# Altium schematic sheet MAX2771-eval.SchDoc
size D
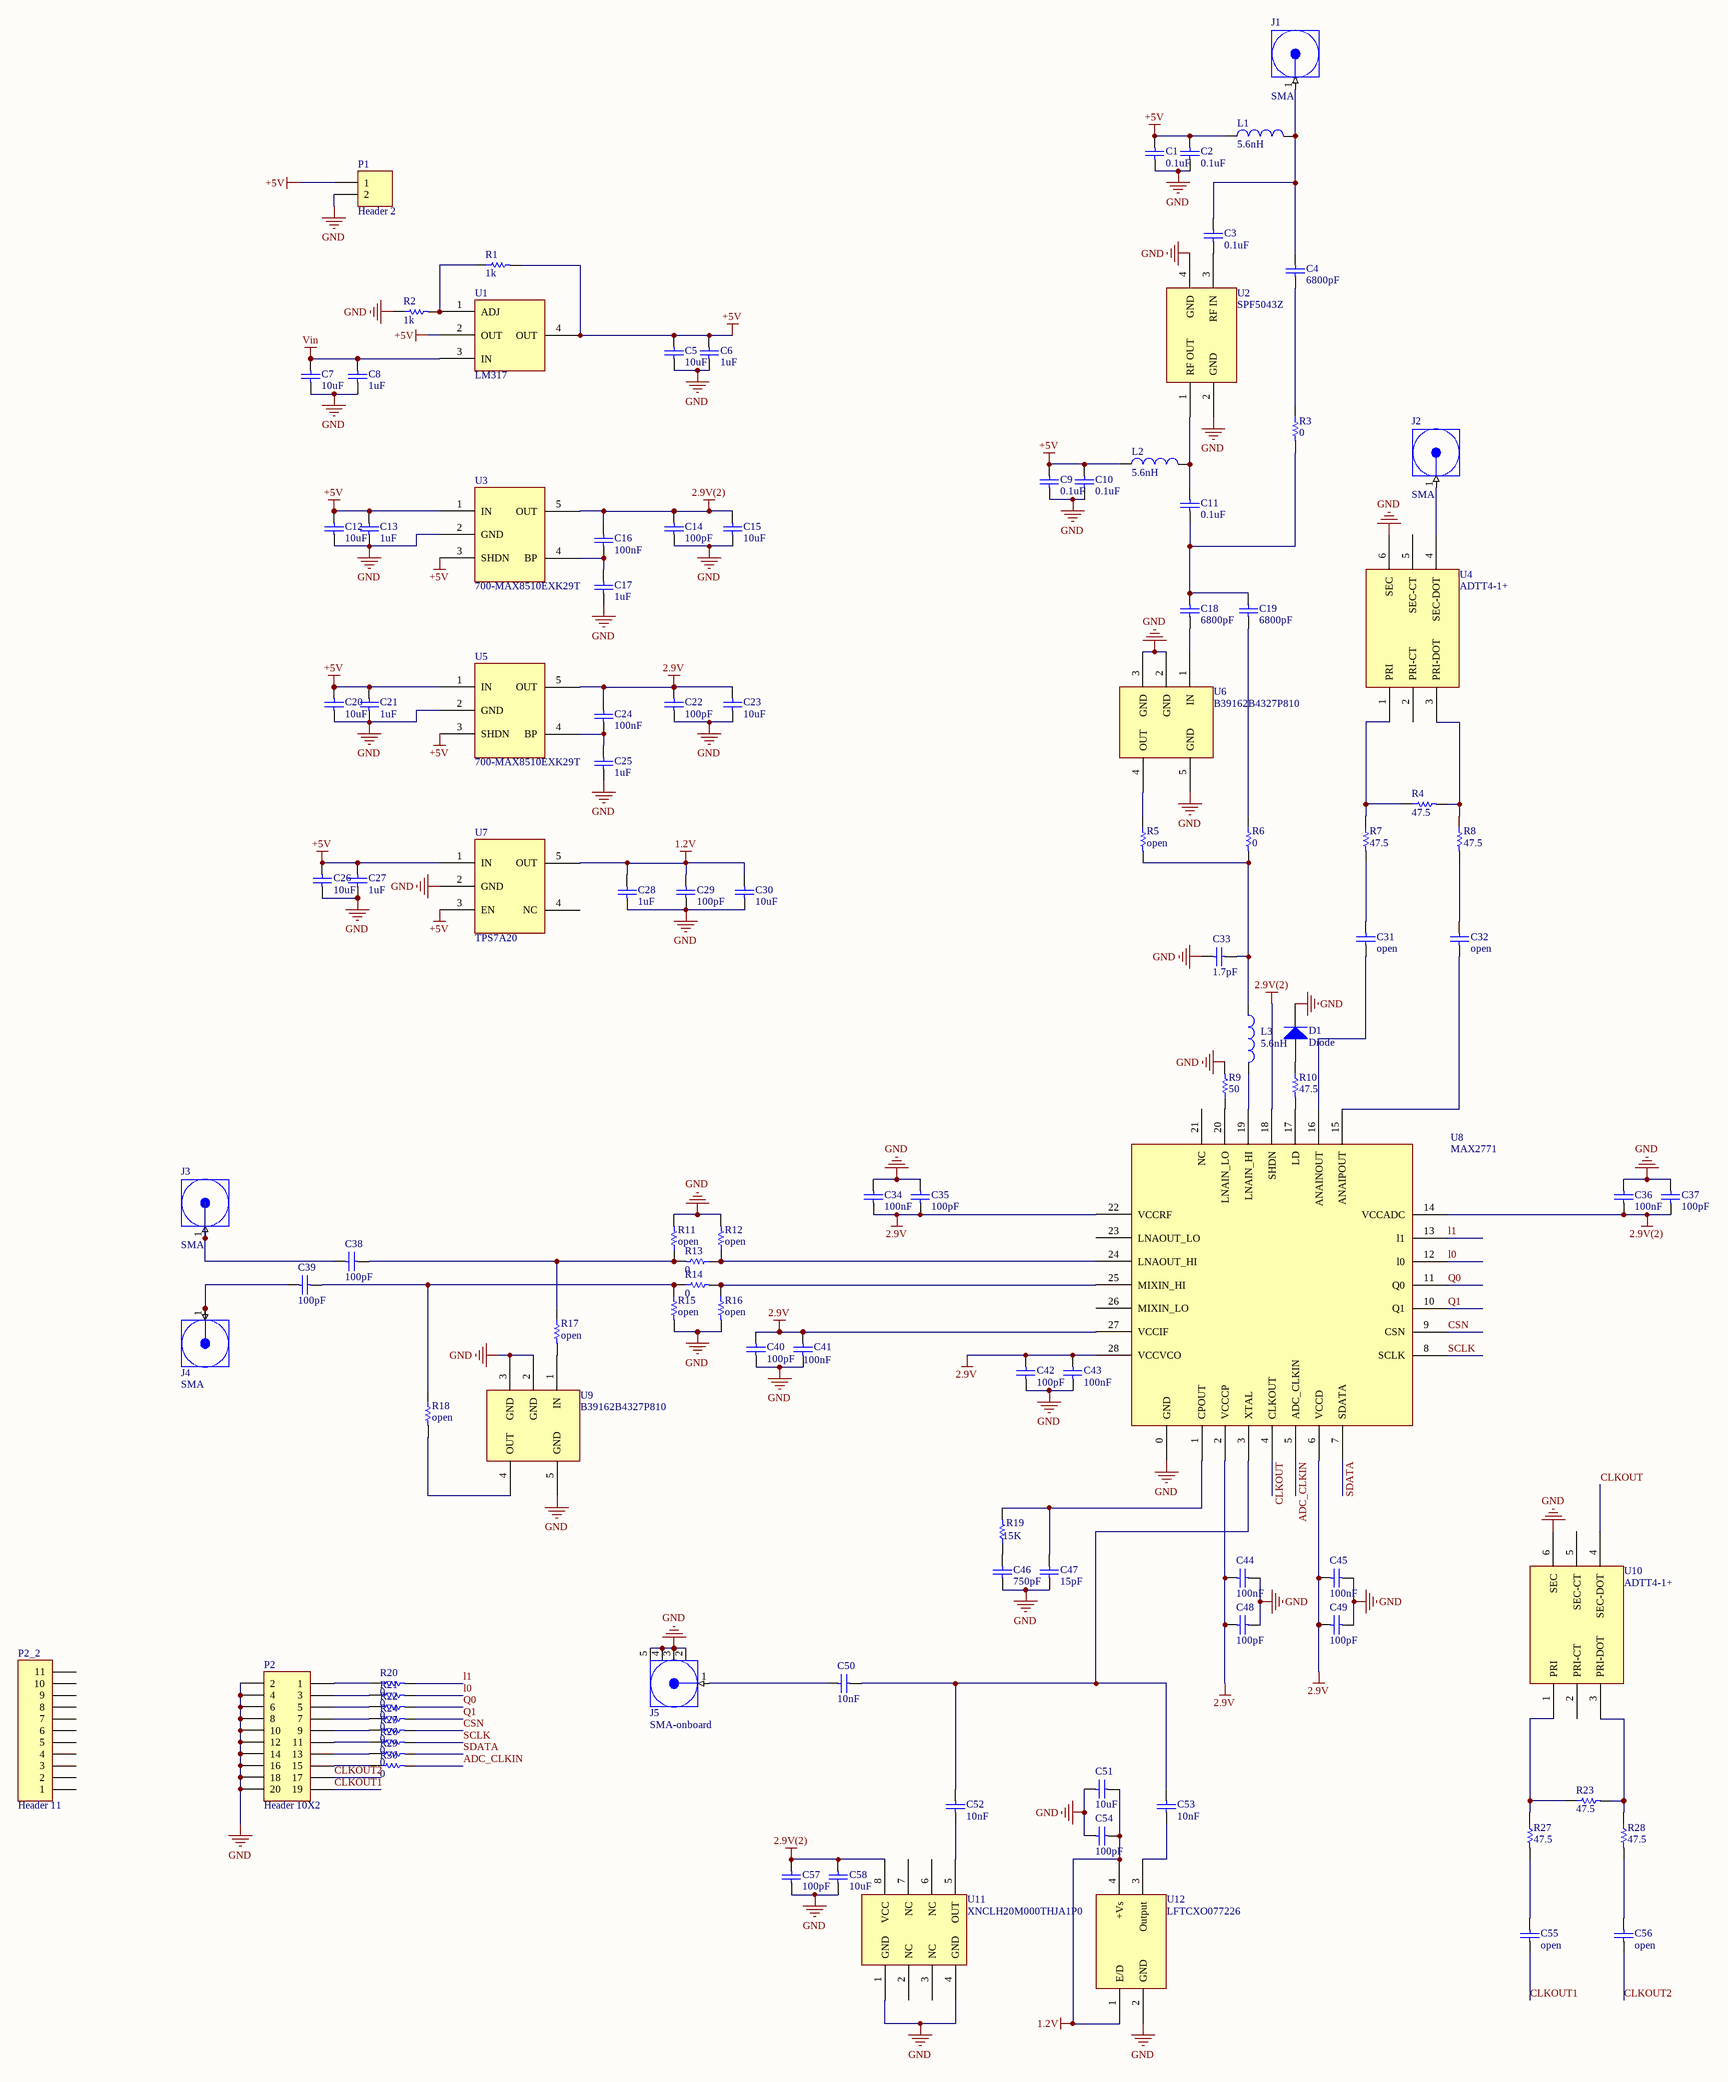
[diagram p0: MAX2771-eval.SchDoc]

## Parts
C1  value 0.1uF  [0603]  (hidden comment: Cap)
C2  value 0.1uF  [0603]  (hidden comment: Cap)
C3  value 0.1uF  [0603]  (hidden comment: Cap)
C4  value 6800pF  [0603]  (hidden comment: Cap)
C5  value 10uF  [0603]  (hidden comment: Cap)
C6  value 1uF  [0603]  (hidden comment: Cap)
C7  value 10uF  [0603]  (hidden comment: Cap)
C8  value 1uF  [0603]  (hidden comment: Cap)
C9  value 0.1uF  [0603]  (hidden comment: Cap)
C10  value 0.1uF  [0603]  (hidden comment: Cap)
C11  value 0.1uF  [0603]  (hidden comment: Cap)
C12  value 10uF  [0603]  (hidden comment: Cap)
C13  value 1uF  [0603]  (hidden comment: Cap)
C14  value 100pF  [0603]  (hidden comment: Cap)
C15  value 10uF  [0603]  (hidden comment: Cap)
C16  value 100nF  [0603]  (hidden comment: Cap)
C17  value 1uF  [0603]  (hidden comment: Cap)
C18  value 6800pF  [0603]  (hidden comment: Cap)
C19  value 6800pF  [0603]  (hidden comment: Cap)
C20  value 10uF  [0603]  (hidden comment: Cap)
C21  value 1uF  [0603]  (hidden comment: Cap)
C22  value 100pF  [0603]  (hidden comment: Cap)
C23  value 10uF  [0603]  (hidden comment: Cap)
C24  value 100nF  [0603]  (hidden comment: Cap)
C25  value 1uF  [0603]  (hidden comment: Cap)
C26  value 10uF  [0603]  (hidden comment: Cap)
C27  value 1uF  [0603]  (hidden comment: Cap)
C28  value 1uF  [0603]  (hidden comment: Cap)
C29  value 100pF  [0603]  (hidden comment: Cap)
C30  value 10uF  [0603]  (hidden comment: Cap)
C31  value open  [0603]  (hidden comment: Cap)
C32  value open  [0603]  (hidden comment: Cap)
C33  value 1.7pF  [0603]  (hidden comment: Cap)
C34  value 100nF  [0603]  (hidden comment: Cap)
C35  value 100pF  [0603]  (hidden comment: Cap)
C36  value 100nF  [0603]  (hidden comment: Cap)
C37  value 100pF  [0603]  (hidden comment: Cap)
C38  value 100pF  [0603]  (hidden comment: Cap)
C39  value 100pF  [0603]  (hidden comment: Cap)
C40  value 100pF  [0603]  (hidden comment: Cap)
C41  value 100nF  [0603]  (hidden comment: Cap)
C42  value 100pF  [0603]  (hidden comment: Cap)
C43  value 100nF  [0603]  (hidden comment: Cap)
C44  value 100nF  [0603]  (hidden comment: Cap)
C45  value 100nF  [0603]  (hidden comment: Cap)
C46  value 750pF  [0603]  (hidden comment: Cap)
C47  value 15pF  [0603]  (hidden comment: Cap)
C48  value 100pF  [0603]  (hidden comment: Cap)
C49  value 100pF  [0603]  (hidden comment: Cap)
C50  value 10nF  [0603]  (hidden comment: Cap)
C51  value 10uF  [0603]  (hidden comment: Cap)
C52  value 10nF  [0603]  (hidden comment: Cap)
C53  value 10nF  [0603]  (hidden comment: Cap)
C54  value 100pF  [0603]  (hidden comment: Cap)
C55  value open  [0603]  (hidden comment: Cap)
C56  value open  [0603]  (hidden comment: Cap)
C57  value 100pF  [0603]  (hidden comment: Cap)
C58  value 10uF  [0603]  (hidden comment: Cap)
D1  Diode  [0603]
J1  SMA  [SMA]
J2  SMA  [SMA]
J3  SMA  [SMA]
J4  SMA  [SMA]
J5  SMA-onboard  [SMA-onboard]
L1  value 5.6nH  [0603]  (hidden comment: Inductor)
L2  value 5.6nH  [0603]  (hidden comment: Inductor)
L3  value 5.6nH  [0603]  (hidden comment: Inductor)
P1  Header 2  [HDR1X2]
P2  Header 10X2  [HDR2X10]
P2_2  Header 11  [HDR1X11]
R1  value 1k  [0603]  (hidden comment: Res1)
R2  value 1k  [0603]  (hidden comment: Res1)
R3  value 0  [0603]  (hidden comment: Res1)
R4  value 47.5  [0603]  (hidden comment: Res1)
R5  value open  [0603]  (hidden comment: Res1)
R6  value 0  [0603]  (hidden comment: Res1)
R7  value 47.5  [0603]  (hidden comment: Res1)
R8  value 47.5  [0603]  (hidden comment: Res1)
R9  value 50  [0603]  (hidden comment: Res1)
R10  value 47.5  [0603]  (hidden comment: Res1)
R11  value open  [0603]  (hidden comment: Res1)
R12  value open  [0603]  (hidden comment: Res1)
R13  value 0  [0603]  (hidden comment: Res1)
R14  value 0  [0603]  (hidden comment: Res1)
R15  value open  [0603]  (hidden comment: Res1)
R16  value open  [0603]  (hidden comment: Res1)
R17  value open  [0603]  (hidden comment: Res1)
R18  value open  [0603]  (hidden comment: Res1)
R19  value 15K  [0603]  (hidden comment: Res1)
R20  value 0  [0402]  (hidden comment: Res1)
R21  value 0  [0402]  (hidden comment: Res1)
R22  value 0  [0402]  (hidden comment: Res1)
R23  value 47.5  [0603]  (hidden comment: Res1)
R24  value 0  [0402]  (hidden comment: Res1)
R25  value 0  [0402]  (hidden comment: Res1)
R26  value 0  [0402]  (hidden comment: Res1)
R27  value 47.5  [0603]  (hidden comment: Res1)
R28  value 47.5  [0603]  (hidden comment: Res1)
R29  value 0  [0402]  (hidden comment: Res1)
R30  value 0  [0402]  (hidden comment: Res1)
U1  LM317  [SOT223]
U2  SPF5043Z  [SPF5043Z]
U3  700-MAX8510EXK29T  [SC70]
U4  ADTT4-1+  [ADTT4-1+]
U5  700-MAX8510EXK29T  [SC70]
U6  B39162B4327P810  [B39162B4327P810]
U7  TPS7A20  [SOT23-5]
U8  MAX2771  [MAX2771]
U9  B39162B4327P810  [B39162B4327P810]
U10  ADTT4-1+  [ADTT4-1+]
U11  XNCLH20M000THJA1P0  [XNCLH20M000THJA1P0]
U12  LFTCXO077226  [IQXT-225]

## Nets
1.2V: C28.2 C29.2 C30.2 C51.2 C54.2 U7.5(OUT) U12.1(E/D) U12.4(+Vs)
2.9V: C22.2 C23.2 C24.2 C34.2 C35.2 C40.2 C41.2 C42.2 C43.2 C44.2 C45.2 C48.2 C49.2 U5.5(OUT) U8.2(VCCCP) U8.6(VCCD) U8.22(VCCRF) U8.27(VCCIF) U8.28(VCCVCO)
2.9V(2): C14.2 C15.2 C16.2 C36.2 C37.2 C57.2 C58.2 U3.5(OUT) U8.14(VCCADC) U8.18(SHDN) U11.8(VCC)
+5V: C1.1 C2.1 C5.2 C6.2 C9.1 C10.1 C12.2 C13.2 C20.2 C21.2 C26.2 C27.2 L1.1 L2.1 P1.1 R1.2 U1.2(OUT) U1.4(OUT) U3.1(IN) U3.3(SHDN) U5.1(IN) U5.3(SHDN) U7.1(IN) U7.3(EN)
GND: C1.2 C2.2 C5.1 C6.1 C7.1 C8.1 C9.2 C10.2 C12.1 C13.1 C14.1 C15.1 C17.1 C20.1 C21.1 C22.1 C23.1 C25.1 C26.1 C27.1 C28.1 C29.1 C30.1 C33.2 C34.1 C35.1 C36.1 C37.1 C40.1 C41.1 C42.1 C43.1 C44.1 C45.1 C46.1 C47.1 C48.1 C49.1 C51.1 C54.1 C57.1 C58.1 D1.2(K) J5.2(GND) J5.3(GND) J5.4(GND) J5.5(GND) P1.2 P2.2 P2.4 P2.6 P2.8 P2.10 P2.12 P2.14 P2.16 P2.18 P2.20 R2.1 R9.2 R11.2 R12.2 R15.2 R16.2 U2.2(GND) U2.4(GND) U3.2(GND) U4.6(SEC) U5.2(GND) U6.2(GND) U6.3(GND) U6.5(GND) U7.2(GND) U8.0(GND) U9.2(GND) U9.3(GND) U9.5(GND) U10.6(SEC) U11.1(GND) U11.4(GND) U12.2(GND)
Vin: C7.2 C8.2 U1.3(IN)
ADC_CLKIN: R30.2 U8.5(ADC_CLKIN)
CLKOUT: U8.4(CLKOUT) U10.4(SEC-DOT)
CLKOUT1: C55.1 P2.19
CLKOUT2: C56.1 P2.17
CSN: R25.2 U8.9(CSN)
l0: R21.2 U8.12(l0)
l1: R20.2 U8.13(l1)
Q0: R22.2 U8.11(Q0)
Q1: R24.2 U8.10(Q1)
SCLK: R26.2 U8.8(SCLK)
SDATA: R29.2 U8.7(SDATA)
NetC3_1: C3.1 C4.1 J1.1(Signal) L1.2
NetC3_2: C3.2 U2.3(RF_IN)
NetC4_2: C4.2 R3.1
NetC11_1: C11.1 L2.2 U2.1(RF_OUT)
NetC11_2: C11.2 C18.1 C19.1 R3.2
NetC16_1: C16.1 C17.2 U3.4(BP)
NetC18_2: C18.2 U6.1(IN)
NetC19_2: C19.2 R6.1
NetC24_1: C24.1 C25.2 U5.4(BP)
NetC31_1: C31.1 U8.16(ANAINOUT)
NetC31_2: C31.2 R7.2
NetC32_1: C32.1 U8.15(ANAIPOUT)
NetC32_2: C32.2 R8.2
NetC33_1: C33.1 L3.1 R5.2 R6.2
NetC38_1: C38.1 R11.1 R13.2 R17.1
NetC38_2: C38.2 J3.1(Signal)
NetC39_1: C39.1 R14.1 R15.1 R18.1
NetC39_2: C39.2 J4.1(Signal)
NetC46_2: C46.2 R19.1
NetC47_2: C47.2 R19.2 U8.1(CPOUT)
NetC50_1: C50.1 C52.2 C53.2 U8.3(XTAL)
NetC50_2: C50.2 J5.1(Signal)
NetC52_1: C52.1 U11.5(OUT)
NetC53_1: C53.1 U12.3(Output)
NetC55_2: C55.2 R27.2
NetC56_2: C56.2 R28.2
NetD1_1: D1.1(A) R10.1
NetJ2_1: J2.1(Signal) U4.4(SEC-DOT)
NetL3_2: L3.2 U8.19(LNAIN_HI)
NetP2_1: P2.1 R20.1
NetP2_3: P2.3 R21.1
NetP2_5: P2.5 R22.1
NetP2_7: P2.7 R24.1
NetP2_9: P2.9 R25.1
NetP2_11: P2.11 R26.1
NetP2_13: P2.13 R29.1
NetP2_15: P2.15 R30.1
NetR1_1: R1.1 R2.2 U1.1(ADJ)
NetR4_1: R4.1 R7.1 U4.1(PRI)
NetR4_2: R4.2 R8.1 U4.3(PRI-DOT)
NetR5_1: R5.1 U6.4(OUT)
NetR9_1: R9.1 U8.20(LNAIN_LO)
NetR10_2: R10.2 U8.17(LD)
NetR12_1: R12.1 R13.1 U8.24(LNAOUT_HI)
NetR14_2: R14.2 R16.1 U8.25(MIXIN_HI)
NetR17_2: R17.2 U9.1(IN)
NetR18_2: R18.2 U9.4(OUT)
NetR23_1: R23.1 R27.1 U10.1(PRI)
NetR23_2: R23.2 R28.1 U10.3(PRI-DOT)

Not connected (* = marked no-connect by the designer): P2_2 1 2 3 4 5 6 7 8 9 10 11; U4 2(PRI-CT) 5(SEC-CT); U7 4(NC); U8 21(NC) 23(LNAOUT_LO) 26(MIXIN_LO); U10 2(PRI-CT) 5(SEC-CT); U11 2(NC) 3(NC) 6(NC) 7(NC)

## Library data of the parts
C1-C58 = Cap: Capacitor; Published: 8-Jun-2000; LatestRevisionDate: 17-Jul-2002; LatestRevisionNote: Re-released for DXP Platform.; PackageReference: RAD-0.3; Publisher: Altium Limited; PackageDescription: Radial Cap, Thru-Hole; 2 Leads; 0.3 in Pin Spacing
D1 = Diode: Default Diode; Published: 8-Jun-2000; LatestRevisionDate: 17-Jul-2002; LatestRevisionNote: Re-released for DXP Platform.; PackageVersion: Sep-1996; PackageReference: SMC; Publisher: Altium Limited; PackageDescription: DO-214-AB/SMC; 2 C-Bend Leads; Body 7.9 x 5.9 mm, inc. leads (LxW); Code_JEDEC: DO-214-AB
L1-L3 = Inductor: Code_IEC: 1005; Published: 8-Jun-2000; LatestRevisionDate: 29-May-2009; LatestRevisionNote: IPC-7351 Footprint Added.; PackageReference: 0402-A; Publisher: Altium Limited; PackageDescription: Chip Inductor; Code_JEITA: 0402
P1 = Header 2: Header, 2-Pin; LatestRevisionDate: 17-Jul-2002; LatestRevisionNote: Re-released for DXP Platform.; Publisher: Altium Limited
P2 = Header 10X2: Header, 10-Pin, Dual row; LatestRevisionDate: 17-Jul-2002; LatestRevisionNote: Re-released for DXP Platform.; Publisher: Altium Limited
P2_2 = Header 11: Header, 11-Pin; LatestRevisionDate: 17-Jul-2002; LatestRevisionNote: Re-released for DXP Platform.; Publisher: Altium Limited
R1-R30 = Res1: Resistor; Published: 8-Jun-2000; LatestRevisionDate: 17-Jul-2002; LatestRevisionNote: Re-released for DXP Platform.; PackageReference: AXIAL-0.3; Publisher: Altium Limited; PackageDescription: Axial Device, Thru-Hole; 2 Leads; 0.3 in Pin Spacing
U8 = MAX2771: Multiband Universal GNSS Receiver